# Altium schematic sheet ConstantLED.SchDoc
size A
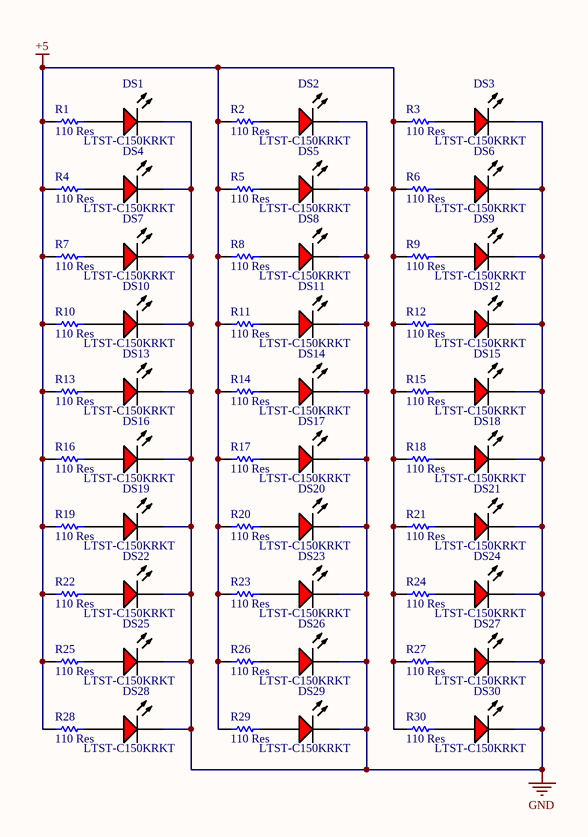
[diagram p0: ConstantLED.SchDoc]

## Parts
DS1  LTST-C150KRKT  [LTST-C150KRKT_V]
DS2  LTST-C150KRKT  [LTST-C150KRKT_V]
DS3  LTST-C150KRKT  [LTST-C150KRKT_V]
DS4  LTST-C150KRKT  [LTST-C150KRKT_V]
DS5  LTST-C150KRKT  [LTST-C150KRKT_V]
DS6  LTST-C150KRKT  [LTST-C150KRKT_V]
DS7  LTST-C150KRKT  [LTST-C150KRKT_V]
DS8  LTST-C150KRKT  [LTST-C150KRKT_V]
DS9  LTST-C150KRKT  [LTST-C150KRKT_V]
DS10  LTST-C150KRKT  [LTST-C150KRKT_V]
DS11  LTST-C150KRKT  [LTST-C150KRKT_V]
DS12  LTST-C150KRKT  [LTST-C150KRKT_V]
DS13  LTST-C150KRKT  [LTST-C150KRKT_V]
DS14  LTST-C150KRKT  [LTST-C150KRKT_V]
DS15  LTST-C150KRKT  [LTST-C150KRKT_V]
DS16  LTST-C150KRKT  [LTST-C150KRKT_V]
DS17  LTST-C150KRKT  [LTST-C150KRKT_V]
DS18  LTST-C150KRKT  [LTST-C150KRKT_V]
DS19  LTST-C150KRKT  [LTST-C150KRKT_V]
DS20  LTST-C150KRKT  [LTST-C150KRKT_V]
DS21  LTST-C150KRKT  [LTST-C150KRKT_V]
DS22  LTST-C150KRKT  [LTST-C150KRKT_V]
DS23  LTST-C150KRKT  [LTST-C150KRKT_V]
DS24  LTST-C150KRKT  [LTST-C150KRKT_V]
DS25  LTST-C150KRKT  [LTST-C150KRKT_V]
DS26  LTST-C150KRKT  [LTST-C150KRKT_V]
DS27  LTST-C150KRKT  [LTST-C150KRKT_V]
DS28  LTST-C150KRKT  [LTST-C150KRKT_V]
DS29  LTST-C150KRKT  [LTST-C150KRKT_V]
DS30  LTST-C150KRKT  [LTST-C150KRKT_V]
R1  110 Res  [RESC3216X70X50LL05T20]
R2  110 Res  [RESC3216X70X50LL05T20]
R3  110 Res  [RESC3216X70X50LL05T20]
R4  110 Res  [RESC3216X70X50LL05T20]
R5  110 Res  [RESC3216X70X50LL05T20]
R6  110 Res  [RESC3216X70X50LL05T20]
R7  110 Res  [RESC3216X70X50LL05T20]
R8  110 Res  [RESC3216X70X50LL05T20]
R9  110 Res  [RESC3216X70X50LL05T20]
R10  110 Res  [RESC3216X70X50LL05T20]
R11  110 Res  [RESC3216X70X50LL05T20]
R12  110 Res  [RESC3216X70X50LL05T20]
R13  110 Res  [RESC3216X70X50LL05T20]
R14  110 Res  [RESC3216X70X50LL05T20]
R15  110 Res  [RESC3216X70X50LL05T20]
R16  110 Res  [RESC3216X70X50LL05T20]
R17  110 Res  [RESC3216X70X50LL05T20]
R18  110 Res  [RESC3216X70X50LL05T20]
R19  110 Res  [RESC3216X70X50LL05T20]
R20  110 Res  [RESC3216X70X50LL05T20]
R21  110 Res  [RESC3216X70X50LL05T20]
R22  110 Res  [RESC3216X70X50LL05T20]
R23  110 Res  [RESC3216X70X50LL05T20]
R24  110 Res  [RESC3216X70X50LL05T20]
R25  110 Res  [RESC3216X70X50LL05T20]
R26  110 Res  [RESC3216X70X50LL05T20]
R27  110 Res  [RESC3216X70X50LL05T20]
R28  110 Res  [RESC3216X70X50LL05T20]
R29  110 Res  [RESC3216X70X50LL05T20]
R30  110 Res  [RESC3216X70X50LL05T20]

## Nets
+5: R1.1 R2.1 R3.1 R4.1 R5.1 R6.1 R7.1 R8.1 R9.1 R10.1 R11.1 R12.1 R13.1 R14.1 R15.1 R16.1 R17.1 R18.1 R19.1 R20.1 R21.1 R22.1 R23.1 R24.1 R25.1 R26.1 R27.1 R28.1 R29.1 R30.1
GND: DS1.2(K) DS2.2(K) DS3.2(K) DS4.2(K) DS5.2(K) DS6.2(K) DS7.2(K) DS8.2(K) DS9.2(K) DS10.2(K) DS11.2(K) DS12.2(K) DS13.2(K) DS14.2(K) DS15.2(K) DS16.2(K) DS17.2(K) DS18.2(K) DS19.2(K) DS20.2(K) DS21.2(K) DS22.2(K) DS23.2(K) DS24.2(K) DS25.2(K) DS26.2(K) DS27.2(K) DS28.2(K) DS29.2(K) DS30.2(K)
NetDS1_1: DS1.1(A) R1.2
NetDS2_1: DS2.1(A) R2.2
NetDS3_1: DS3.1(A) R3.2
NetDS4_1: DS4.1(A) R4.2
NetDS5_1: DS5.1(A) R5.2
NetDS6_1: DS6.1(A) R6.2
NetDS7_1: DS7.1(A) R7.2
NetDS8_1: DS8.1(A) R8.2
NetDS9_1: DS9.1(A) R9.2
NetDS10_1: DS10.1(A) R10.2
NetDS11_1: DS11.1(A) R11.2
NetDS12_1: DS12.1(A) R12.2
NetDS13_1: DS13.1(A) R13.2
NetDS14_1: DS14.1(A) R14.2
NetDS15_1: DS15.1(A) R15.2
NetDS16_1: DS16.1(A) R16.2
NetDS17_1: DS17.1(A) R17.2
NetDS18_1: DS18.1(A) R18.2
NetDS19_1: DS19.1(A) R19.2
NetDS20_1: DS20.1(A) R20.2
NetDS21_1: DS21.1(A) R21.2
NetDS22_1: DS22.1(A) R22.2
NetDS23_1: DS23.1(A) R23.2
NetDS24_1: DS24.1(A) R24.2
NetDS25_1: DS25.1(A) R25.2
NetDS26_1: DS26.1(A) R26.2
NetDS27_1: DS27.1(A) R27.2
NetDS28_1: DS28.1(A) R28.2
NetDS29_1: DS29.1(A) R29.2
NetDS30_1: DS30.1(A) R30.2

## Library data of the parts
DS1-DS30 = CMP-2000-06617-1: LED Red, 62.5 mW, 50 mA, -30 to 85 degC, 2-Pin SMD, RoHS, Tape and Reel; Manufacturer: Lite-On; Chip Material: AlGaInP; Product Depth (mm): 1.6mm; Luminous Intensity: 54mcd; Number of  Elements: 1; Reverse Voltage: 5V; Viewing Angle: 130deg; Rad Hardened: No; Shape Type: Rectangular; Peak Wavelength: 639nm; Forward Current: 30mA; Main Category: ChipLED; Product Height (mm): 1.1mm; Forward Voltage: 2.4V; Product Length (mm): 3.2mm; High Brightness: Yes; DELETED: Compliant; Test Current (It): 20mA; Power Dissipation: 75W; Type: Uni-Color; Dominant Wave Length: 631nm; Mounting: SurfaceMount; Package Type: ChipLed; Manufacturer URL: http://www.us.liteon.com/; Datasheet Version: Rev. C, 01/2013; Lens Dimensions: 2.06X1.6X0.6mm; Package Reference: C150KRKT; Operating Temp Range: -55Cto85C; Packaging: TapeandReel; Package Description: 2-Pin Surface Mount Device, Body 3.2 x 1.6 mm; Lum Intensity: 54mcd; Datasheet URL: http://optoelectronics.liteon.com/upload/download/DS-22-99-0149/S_110_LTST-C150KRKT.pdf; Emitting Color: Red; Operating Temperature Classification: Industrial; Mounting Technology: SurfaceMount; Pin Count: 2
R1-R30 = CMP-2003-00040-1: Part Number: ERJ-8ENF1100V; Manufacturer: Panasonic